# EAGLE design voltageconverter (EAGLE 5.06)
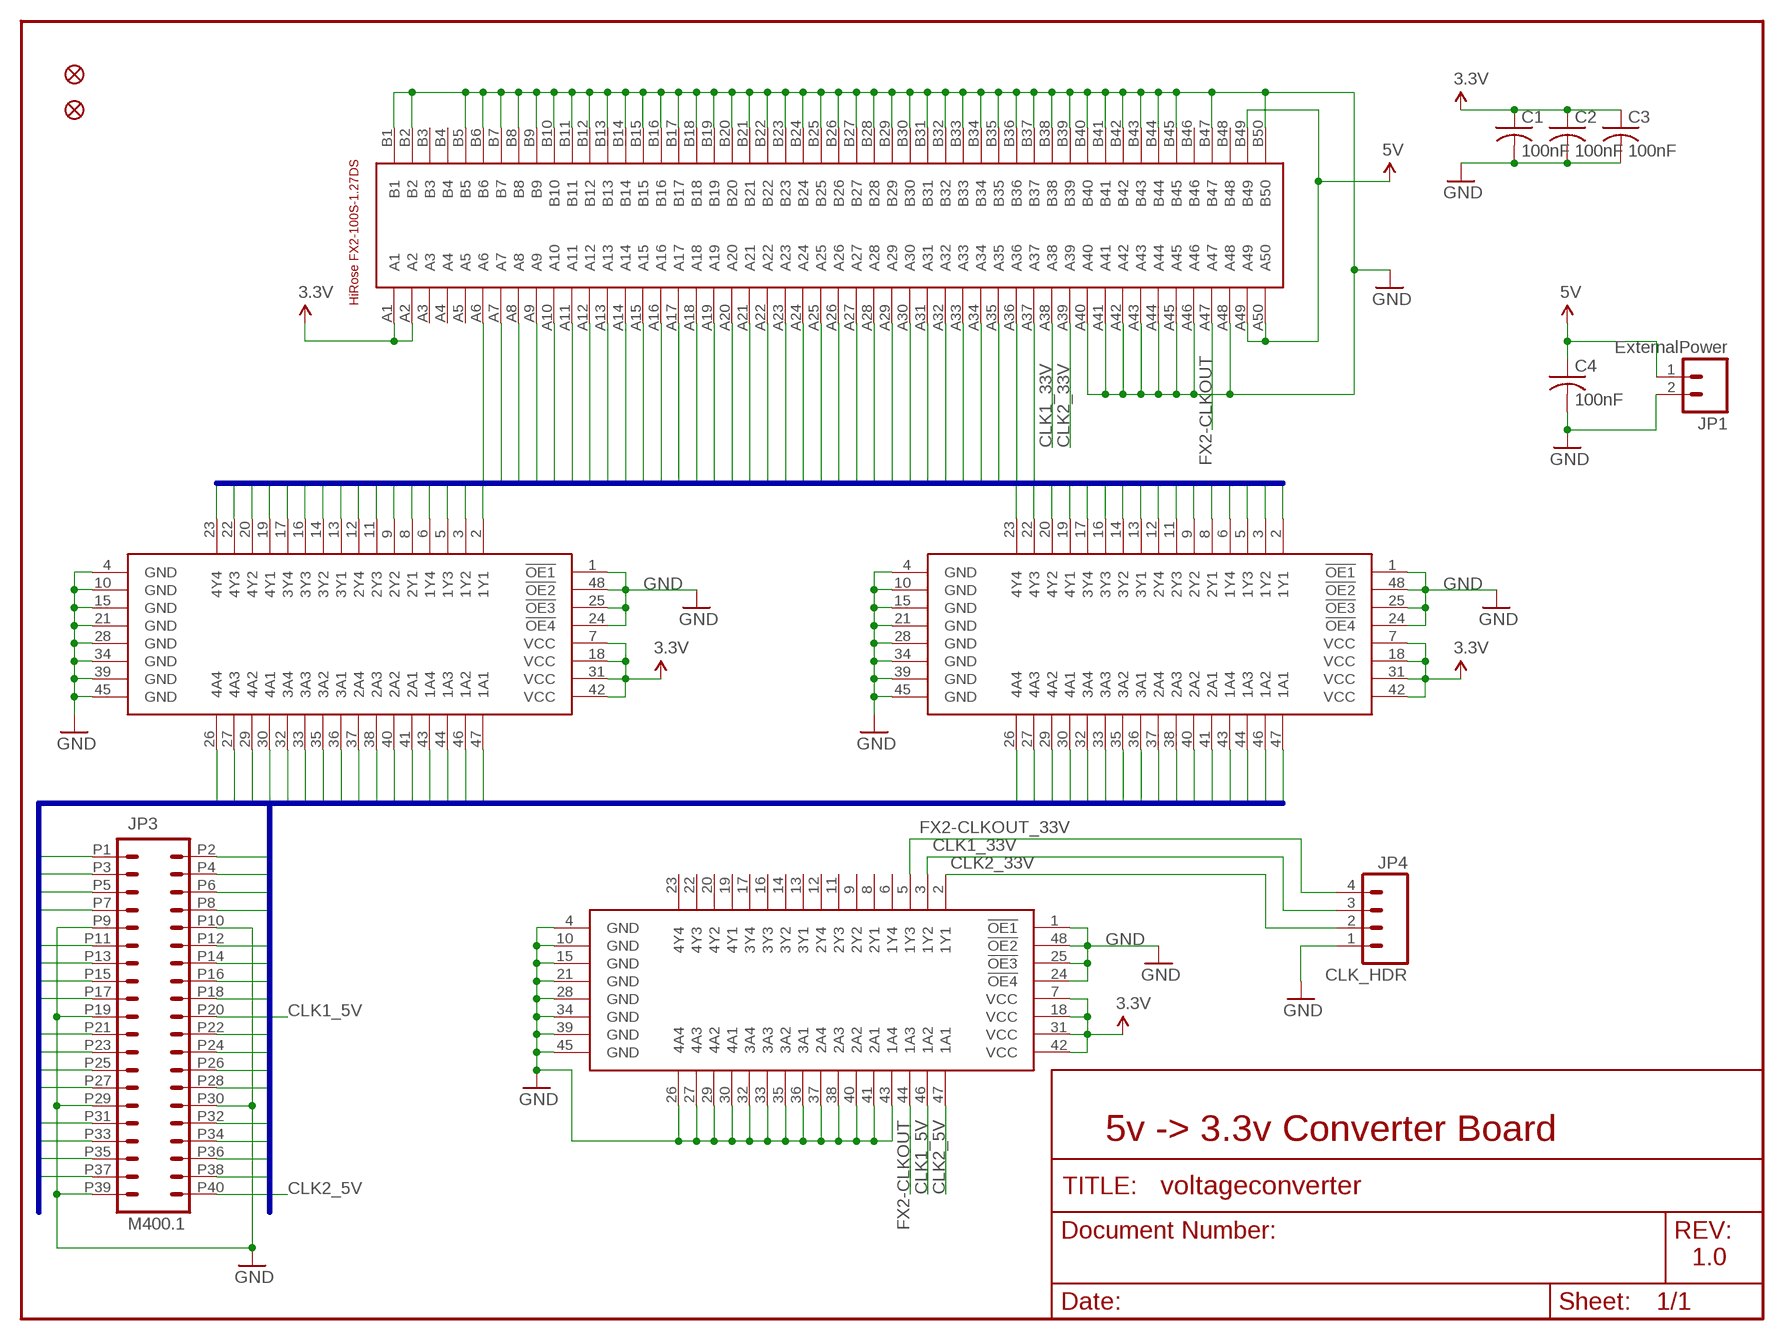
[diagram p0: schematic, sheet 1]

## Parts
C1  100nF  C-US025-025X050  [C025-025X050]
C2  100nF  C-US025-025X050  [C025-025X050]
C3  100nF  C-US025-025X050  [C025-025X050]
C4  100nF  C-US025-025X050  [C025-025X050]
JP1  ExternalPower  M02PTH  [1X02]
JP3  M400.1  M40  [2X20]
JP4  CLK_HDR  M04PTH  [1X04]
U$1  HIROSE-FX2-100S-1.27DS  [HIROSE-FX2-100]
U$3  SN74ALVTH16244GR  [TSSOP48]
U$4  SN74ALVTH16244GR  [TSSOP48]
U$5  SN74ALVTH16244GR  [TSSOP48]
U$6  FIDUCIAL1X2  [FIDUCIAL-1X2]
U$7  FIDUCIAL1X2  [FIDUCIAL-1X2]

## Nets
3.3V: C1.1 C2.1 C3.1 U$1.A1 U$1.A2 U$3.7(VCC) U$3.18(VCC) U$3.31(VCC) U$3.42(VCC) U$4.7(VCC) U$4.18(VCC) U$4.31(VCC) U$4.42(VCC) U$5.7(VCC) U$5.18(VCC) U$5.31(VCC) U$5.42(VCC)
5V: C4.1 JP1.1 U$1.A49 U$1.A50 U$1.B49
CLK1_5V: JP3.P20 U$5.46(1A2)
CLK1_33V: JP4.3 U$1.A38 U$5.3(1Y2)
CLK2_5V: JP3.P40 U$5.47(1A1)
CLK2_33V: JP4.2 U$1.A39 U$5.2(1Y1)
FX2-CLKOUT: U$1.A47 U$5.44(1A3)
FX2-CLKOUT_33V: JP4.4 U$5.5(1Y3)
GND: C1.2 C2.2 C3.2 C4.2 JP1.2 JP3.P9 JP3.P10 JP3.P19 JP3.P29 JP3.P30 JP3.P39 JP4.1 U$1.A40 U$1.A41 U$1.A42 U$1.A43 U$1.A44 U$1.A45 U$1.A46 U$1.A48 U$1.B1 U$1.B2 U$1.B5 U$1.B6 U$1.B7 U$1.B8 U$1.B9 U$1.B10 U$1.B11 U$1.B12 U$1.B13 U$1.B14 U$1.B15 U$1.B16 U$1.B17 U$1.B18 U$1.B19 U$1.B20 U$1.B21 U$1.B22 U$1.B23 U$1.B24 U$1.B25 U$1.B26 U$1.B27 U$1.B28 U$1.B29 U$1.B30 U$1.B31 U$1.B32 U$1.B33 U$1.B34 U$1.B35 U$1.B36 U$1.B37 U$1.B38 U$1.B39 U$1.B40 U$1.B41 U$1.B42 U$1.B43 U$1.B44 U$1.B45 U$1.B47 U$1.B50 U$3.1(!OE1) U$3.4(GND) U$3.10(GND) U$3.15(GND) U$3.21(GND) U$3.24(!OE4) U$3.25(!OE3) U$3.28(GND) U$3.34(GND) U$3.39(GND) U$3.45(GND) U$3.48(!OE2) U$4.1(!OE1) U$4.4(GND) U$4.10(GND) U$4.15(GND) U$4.21(GND) U$4.24(!OE4) U$4.25(!OE3) U$4.28(GND) U$4.34(GND) U$4.39(GND) U$4.45(GND) U$4.48(!OE2) U$5.1(!OE1) U$5.4(GND) U$5.10(GND) U$5.15(GND) U$5.21(GND) U$5.24(!OE4) U$5.25(!OE3) U$5.26(4A4) U$5.27(4A3) U$5.28(GND) U$5.29(4A2) U$5.30(4A1) U$5.32(3A4) U$5.33(3A3) U$5.34(GND) U$5.35(3A2) U$5.36(3A1) U$5.37(2A4) U$5.38(2A3) U$5.39(GND) U$5.40(2A2) U$5.41(2A1) U$5.43(1A4) U$5.45(GND) U$5.48(!OE2)
PROBEINPUT0: U$1.A6 U$4.23(4Y4)
PROBEINPUT1: U$1.A7 U$4.22(4Y3)
PROBEINPUT2: U$1.A8 U$4.20(4Y2)
PROBEINPUT3: U$1.A9 U$4.19(4Y1)
PROBEINPUT4: U$1.A10 U$4.17(3Y4)
PROBEINPUT5: U$1.A11 U$4.16(3Y3)
PROBEINPUT6: U$1.A12 U$4.14(3Y2)
PROBEINPUT7: U$1.A13 U$4.13(3Y1)
PROBEINPUT8: U$1.A14 U$4.12(2Y4)
PROBEINPUT9: U$1.A15 U$4.11(2Y3)
PROBEINPUT10: U$1.A16 U$4.9(2Y2)
PROBEINPUT11: U$1.A17 U$4.8(2Y1)
PROBEINPUT12: U$1.A18 U$4.6(1Y4)
PROBEINPUT13: U$1.A19 U$4.5(1Y3)
PROBEINPUT14: U$1.A20 U$4.3(1Y2)
PROBEINPUT15: U$1.A21 U$4.2(1Y1)
PROBEINPUT16: U$1.A22 U$3.23(4Y4)
PROBEINPUT17: U$1.A23 U$3.22(4Y3)
PROBEINPUT18: U$1.A24 U$3.20(4Y2)
PROBEINPUT19: U$1.A25 U$3.19(4Y1)
PROBEINPUT20: U$1.A26 U$3.17(3Y4)
PROBEINPUT21: U$1.A27 U$3.16(3Y3)
PROBEINPUT22: U$1.A28 U$3.14(3Y2)
PROBEINPUT23: U$1.A29 U$3.13(3Y1)
PROBEINPUT24: U$1.A30 U$3.12(2Y4)
PROBEINPUT25: U$1.A31 U$3.11(2Y3)
PROBEINPUT26: U$1.A32 U$3.9(2Y2)
PROBEINPUT27: U$1.A33 U$3.8(2Y1)
PROBEINPUT28: U$1.A34 U$3.6(1Y4)
PROBEINPUT29: U$1.A35 U$3.5(1Y3)
PROBEINPUT30: U$1.A36 U$3.3(1Y2)
PROBEINPUT31: U$1.A37 U$3.2(1Y1)
PROBEINPUT_5V0: JP3.P1 U$4.26(4A4)
PROBEINPUT_5V1: JP3.P2 U$4.27(4A3)
PROBEINPUT_5V2: JP3.P3 U$4.29(4A2)
PROBEINPUT_5V3: JP3.P4 U$4.30(4A1)
PROBEINPUT_5V4: JP3.P5 U$4.32(3A4)
PROBEINPUT_5V5: JP3.P6 U$4.33(3A3)
PROBEINPUT_5V6: JP3.P7 U$4.35(3A2)
PROBEINPUT_5V7: JP3.P8 U$4.36(3A1)
PROBEINPUT_5V8: JP3.P11 U$4.37(2A4)
PROBEINPUT_5V9: JP3.P12 U$4.38(2A3)
PROBEINPUT_5V10: JP3.P13 U$4.40(2A2)
PROBEINPUT_5V11: JP3.P14 U$4.41(2A1)
PROBEINPUT_5V12: JP3.P15 U$4.43(1A4)
PROBEINPUT_5V13: JP3.P16 U$4.44(1A3)
PROBEINPUT_5V14: JP3.P17 U$4.46(1A2)
PROBEINPUT_5V15: JP3.P18 U$4.47(1A1)
PROBEINPUT_5V16: JP3.P21 U$3.26(4A4)
PROBEINPUT_5V17: JP3.P22 U$3.27(4A3)
PROBEINPUT_5V18: JP3.P23 U$3.29(4A2)
PROBEINPUT_5V19: JP3.P24 U$3.30(4A1)
PROBEINPUT_5V20: JP3.P25 U$3.32(3A4)
PROBEINPUT_5V21: JP3.P26 U$3.33(3A3)
PROBEINPUT_5V22: JP3.P27 U$3.35(3A2)
PROBEINPUT_5V23: JP3.P28 U$3.36(3A1)
PROBEINPUT_5V24: JP3.P31 U$3.37(2A4)
PROBEINPUT_5V25: JP3.P32 U$3.38(2A3)
PROBEINPUT_5V26: JP3.P33 U$3.40(2A2)
PROBEINPUT_5V27: JP3.P34 U$3.41(2A1)
PROBEINPUT_5V28: JP3.P35 U$3.43(1A4)
PROBEINPUT_5V29: JP3.P36 U$3.44(1A3)
PROBEINPUT_5V30: JP3.P37 U$3.46(1A2)
PROBEINPUT_5V31: JP3.P38 U$3.47(1A1)
Unconnected: U$1.A3 U$1.A4 U$1.A5 U$1.B3 U$1.B4 U$1.B46 U$1.B48 U$5.6(1Y4) U$5.8(2Y1) U$5.9(2Y2) U$5.11(2Y3) U$5.12(2Y4) U$5.13(3Y1) U$5.14(3Y2) U$5.16(3Y3) U$5.17(3Y4) U$5.19(4Y1) U$5.20(4Y2) U$5.22(4Y3) U$5.23(4Y4)

## Buses
PROBEINPUT[0..31]
PROBEINPUT_5V[0..31]

## Notes on the sheet
- 5v -> 3.3v Converter Board
- 1.0

## Library data of the parts
C1-C4 = rcl:C-US: CAPACITOR, American symbol
JP1 = SparkFun:M02: Header 2 Standard 2-pin 0.1" header. Use with straight break away headers (SKU : PRT-00116), right angle break away headers (PRT-00553), swiss pins (PRT-00743), machine pins (PRT-00117), and female headers (PRT-00115). Molex polarized connector foot print use with SKU : PRT-08233 with associated crimp pins and housings.
JP3 = nall:M40: Header 40 Standard 40-pin 0.1" header. Use with straight break away headers (SKU : PRT-00116), right angle break away headers (PRT-00553), swiss pins (PRT-00743), machine pins (PRT-00117), and female headers (PRT-00115).
JP4 = SparkFun:M04: Header 4 Standard 4-pin 0.1" header. Use with straight break away headers (SKU : PRT-00116), right angle break away headers (PRT-00553), swiss pins (PRT-00743), machine pins (PRT-00117), and female headers (PRT-00115). Molex polarized connector foot print use with SKU : PRT-08231 with associated crimp pins and housings.
U$1 = hirose-fx2-100:HIROSE-FX2-100S-1.27DS
U$3-U$5 = nall:SN74ALVTH16244GR: The ?ALVTH16244 devices are 16-bit buffers/line drivers designed for 2.5-V or 3.3-V VCC operation, but with the capability to provide a TTL interface to a 5-V system environment. These devices can be used as four 4-bit buffers, two 8-bit buffers, or one 16-bit buffer.
U$6 U$7 = SparkFun:FIDUCIAL: Fiducial Alignment Points Various fiducial points for machine vision alignment.

## Board
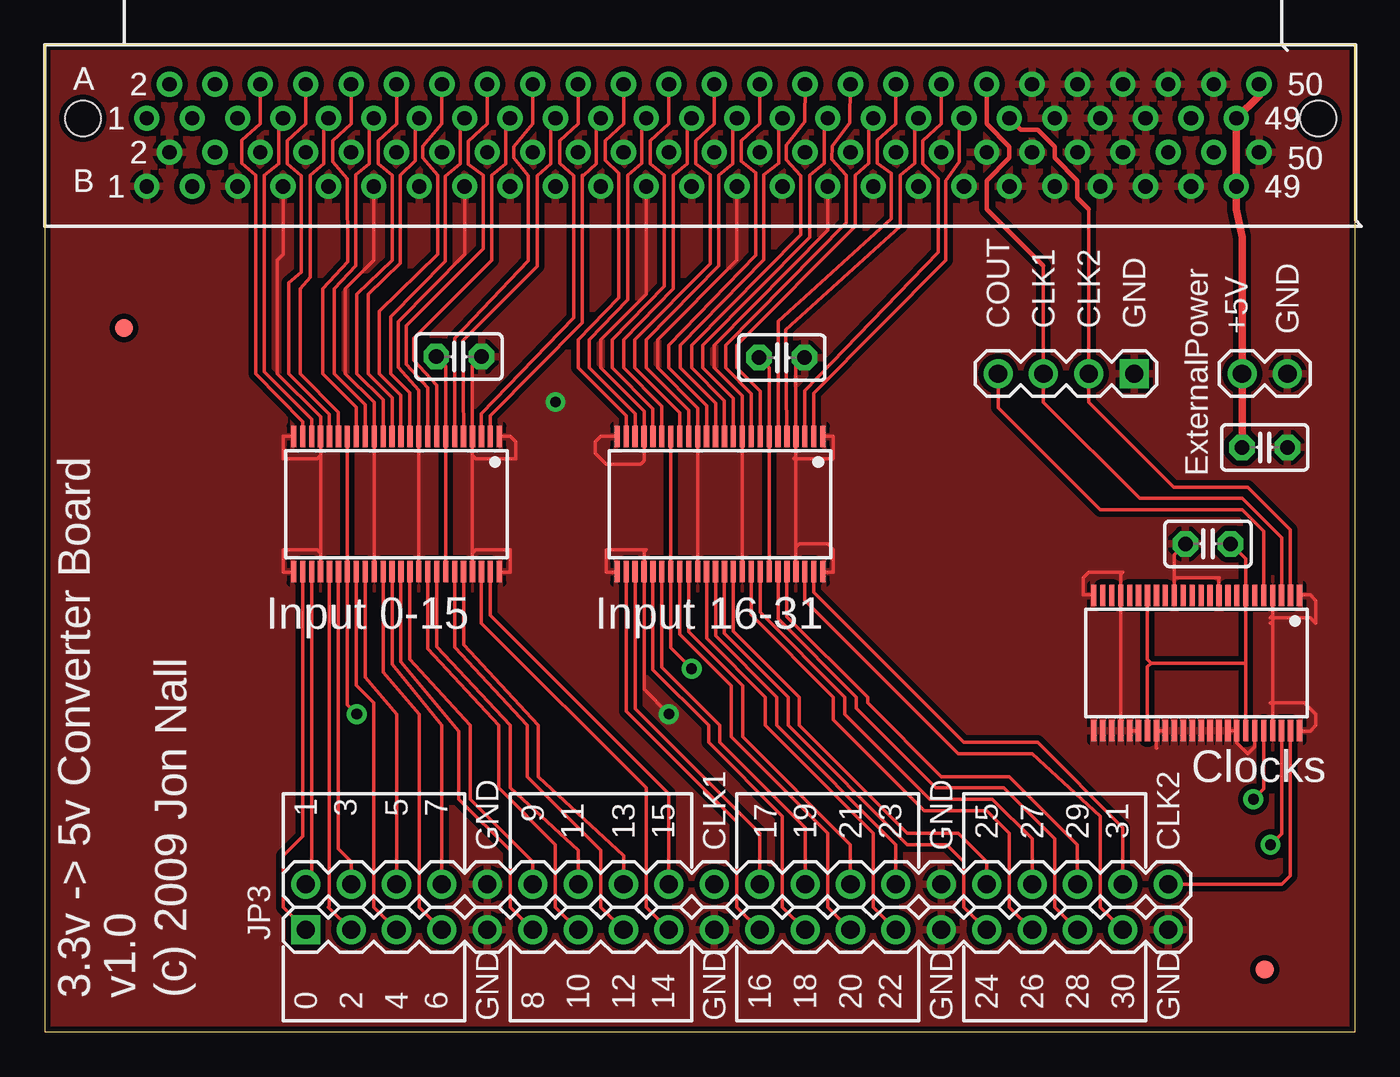
[diagram p1: board, top side]
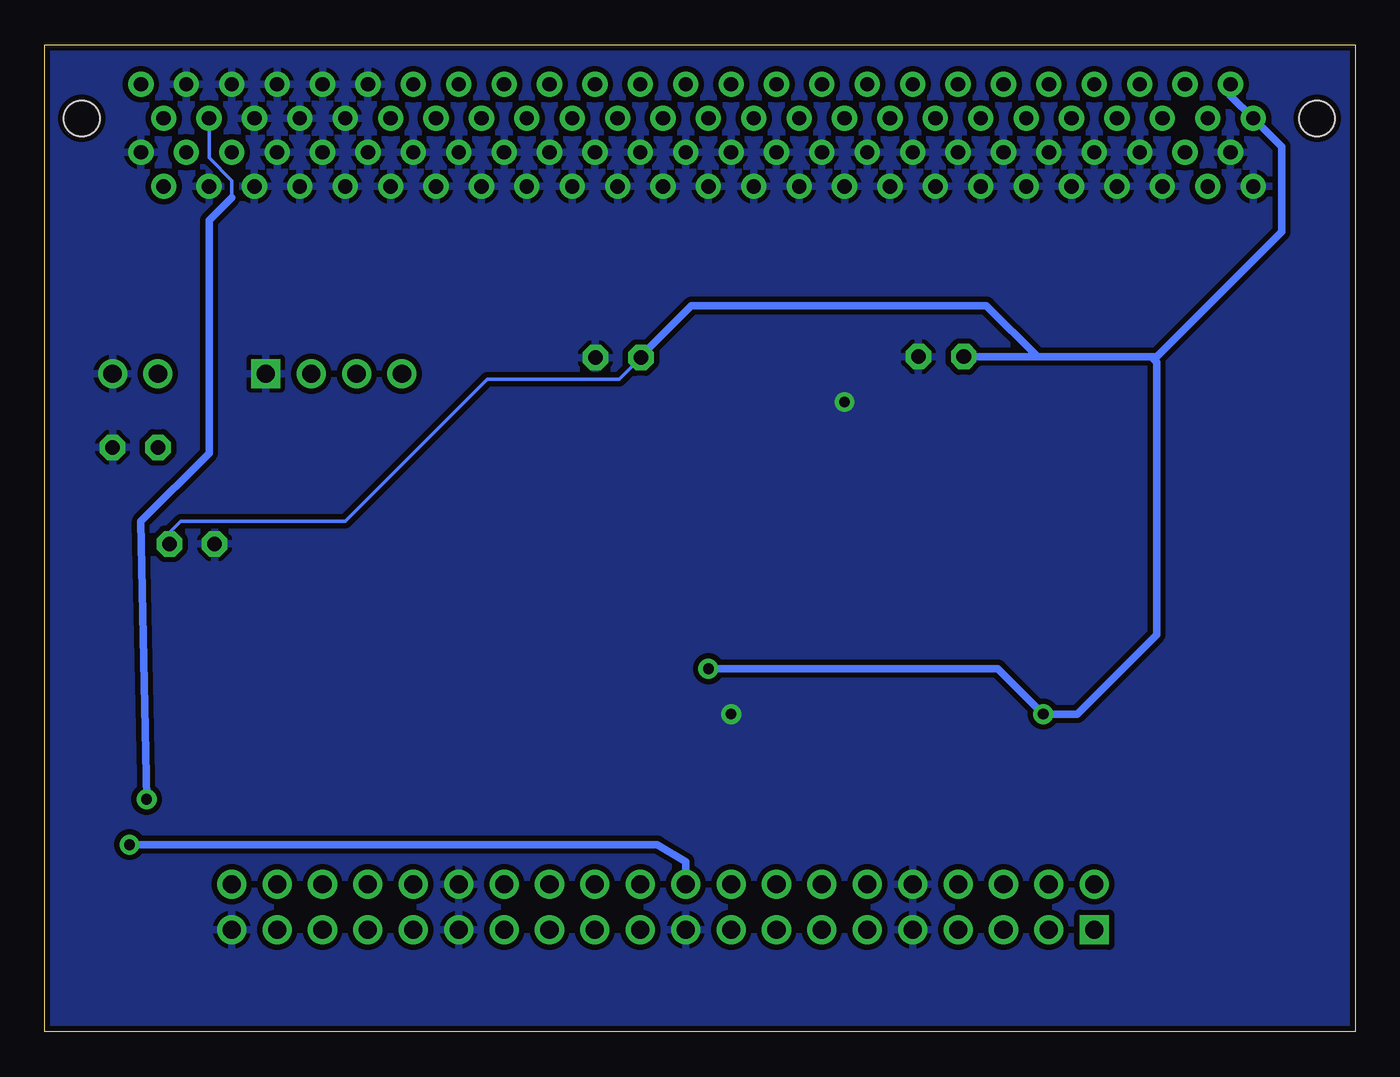
[diagram p2: board, bottom side, seen from below]

Size 73.33 x 55.23 mm. Coordinates in mm from the lower left corner, seen from the top.
Outline: 0,0 73.33,0 73.33,55.23 0,55.23 0,0
Copper layers (1*16): Top 0.035mm / dielectric 1.5mm / Bottom 0.035mm
Design rules "SparkFun": minimum track width 8mil, minimum drill 20mil, track to track 8mil, track to pad 8mil, pad to pad 8mil, via to via 8mil, smd to smd 8mil, copper to edge 10mil, drill to drill 8mil, minimum pad ring 12mil, minimum via ring 10mil, stop-mask expansion 4mil, vias tented up to drill 25mil, thermal gap 10mil

### Footprints (pad centres in the part's own frame; a part is rotated, then mirrored left to right if it is on the bottom)
C025-025X050 = drill 0.813 octagon: 1 -1.27,0; 2 1.27,0
1X02 = drill 1.016 round: 1 0,0; 2 2.54,0
2X20 = drill 1.016 square: P1 0,-2.54 | drill 1.016 round: P2 0,0; P3 2.54,-2.54; P4 2.54,0; P5 5.08,-2.54; P6 5.08,0; P7 7.62,-2.54; P8 7.62,0; P9 10.16,-2.54; P10 10.16,0; P11 12.7,-2.54; P12 12.7,0; P13 15.24,-2.54; P14 15.24,0; P15 17.78,-2.54; P16 17.78,0; P17 20.32,-2.54; P18 20.32,0; P19 22.86,-2.54; P20 22.86,0; P21 25.4,-2.54; P22 25.4,0; P23 27.94,-2.54; P24 27.94,0; P25 30.48,-2.54; P26 30.48,0; P27 33.02,-2.54; P28 33.02,0; P29 35.56,-2.54; P30 35.56,0; P31 38.1,-2.54; P32 38.1,0; P33 40.64,-2.54; P34 40.64,0; P35 43.18,-2.54; P36 43.18,0; P37 45.72,-2.54; P38 45.72,0; P39 48.26,-2.54; P40 48.26,0
1X04 = drill 1.016 square: 1 0,0 | drill 1.016 round: 2 2.54,0; 3 5.08,0; 4 7.62,0
HIROSE-FX2-100 = drill 0.8 round: A1 -44.45,6.985; A2 -43.18,8.89; A3 -41.91,6.985; A4 -40.64,8.89; A5 -39.37,6.985; A6 -38.1,8.89; A7 -36.83,6.985; A8 -35.56,8.89; A9 -34.29,6.985; A10 -33.02,8.89; A11 -31.75,6.985; A12 -30.48,8.89; A13 -29.21,6.985; A14 -27.94,8.89; A15 -26.67,6.985; A16 -25.4,8.89; A17 -24.13,6.985; A18 -22.86,8.89; A19 -21.59,6.985; A20 -20.32,8.89; A21 -19.05,6.985; A22 -17.78,8.89; A23 -16.51,6.985; A24 -15.24,8.89; A25 -13.97,6.985; A26 -12.7,8.89; A27 -11.43,6.985; A28 -10.16,8.89; A29 -8.89,6.985; A30 -7.62,8.89; A31 -6.35,6.985; A32 -5.08,8.89; A33 -3.81,6.985; A34 -2.54,8.89; A35 -1.27,6.985; A36 0,8.89; A37 1.27,6.985; A38 2.54,8.89; A39 3.81,6.985; A40 5.08,8.89; A41 6.35,6.985; A42 7.62,8.89; A43 8.89,6.985; A44 10.16,8.89; A45 11.43,6.985; A46 12.7,8.89; A47 13.97,6.985; A48 15.24,8.89; A49 16.51,6.985; A50 17.78,8.89; B1 -44.45,3.175; B2 -43.18,5.08; B3 -41.91,3.175; B4 -40.64,5.08; B5 -39.37,3.175; B6 -38.1,5.08; B7 -36.83,3.175; B8 -35.56,5.08; B9 -34.29,3.175; B10 -33.02,5.08; B11 -31.75,3.175; B12 -30.48,5.08; B13 -29.21,3.175; B14 -27.94,5.08; B15 -26.67,3.175; B16 -25.4,5.08; B17 -24.13,3.175; B18 -22.86,5.08; B19 -21.59,3.175; B20 -20.32,5.08; B21 -19.05,3.175; B22 -17.78,5.08; B23 -16.51,3.175; B24 -15.24,5.08; B25 -13.97,3.175; B26 -12.7,5.08; B27 -11.43,3.175; B28 -10.16,5.08; B29 -8.89,3.175; B30 -7.62,5.08; B31 -6.35,3.175; B32 -5.08,5.08; B33 -3.81,3.175; B34 -2.54,5.08; B35 -1.27,3.175; B36 0,5.08; B37 1.27,3.175; B38 2.54,5.08; B39 3.81,3.175; B40 5.08,5.08; B41 6.35,3.175; B42 7.62,5.08; B43 8.89,3.175; B44 10.16,5.08; B45 11.43,3.175; B46 12.7,5.08; B47 13.97,3.175; B48 15.24,5.08; B49 16.51,3.175; B50 17.78,5.08 | hole 2: 21.09,6.984; -48.032,6.985
TSSOP48 = smd 0.29 x 1.2: 1 -5.75,-3.775; 2 -5.25,-3.775; 3 -4.75,-3.775; 4 -4.25,-3.775; 5 -3.75,-3.775; 6 -3.25,-3.775; 7 -2.75,-3.775; 8 -2.25,-3.775; 9 -1.75,-3.775; 10 -1.25,-3.775; 11 -0.75,-3.775; 12 -0.25,-3.775; 13 0.25,-3.775; 14 0.75,-3.775; 15 1.25,-3.775; 16 1.75,-3.775; 17 2.25,-3.775; 18 2.75,-3.775; 19 3.25,-3.775; 20 3.75,-3.775; 21 4.25,-3.775; 22 4.75,-3.775; 23 5.25,-3.775; 24 5.75,-3.775; 25 5.75,3.775; 26 5.25,3.775; 27 4.75,3.775; 28 4.25,3.775; 29 3.75,3.775; 30 3.25,3.775; 31 2.75,3.775; 32 2.25,3.775; 33 1.75,3.775; 34 1.25,3.775; 35 0.75,3.775; 36 0.25,3.775; 37 -0.25,3.775; 38 -0.75,3.775; 39 -1.25,3.775; 40 -1.75,3.775; 41 -2.25,3.775; 42 -2.75,3.775; 43 -3.25,3.775; 44 -3.75,3.775; 45 -4.25,3.775; 46 -4.75,3.775; 47 -5.25,3.775; 48 -5.75,3.775
FIDUCIAL-1X2 = smd 1 x 1: 1 0,0

### Placement (x,y rotation side)
C1  65.09,27.3 180 top
C2  41.25,37.72 0 top
C3  23.18,37.78 0 top
C4  68.26,32.7 0 top
JP1  66.99,36.83 0 top
JP3  14.61,8.26 0 top
JP4  60.96,36.83 180 top
U$1  50.16,44.13 0 top
U$3  37.78,29.53 180 top
U$4  19.68,29.53 180 top
U$5  64.45,20.64 180 top
U$6  68.26,3.49 180 top
U$7  4.45,39.37 180 top

### Tracks (layer width: path | path; a pad name or v marks a point on that pad's centre or on a via)
3.3V  (via drill 0.6)
  Top 0.203: C3.1 22.43,37.26 U$4.7 U$4.42 | U$3.42 U$3.7 40.53,37.17 C2.1 | v17.46,17.78 16.93,18.31 U$4.31 U$4.18 | v36.2,20.32 35.03,21.48 U$3.31 U$3.18 | C1.1 67.2,26.46 U$5.7 67.2,20.64 | 67.2,20.64 U$5.42 | U$5.31 61.7,20.43 61.91,20.64 | 67.2,20.64 61.91,20.64 | U$5.18 61.7,20.85 61.91,20.64
  Bottom 0.203: C1.1 66.36,27.94 65.72,28.57 56.52,28.57 48.58,36.51 41.19,36.51 C2.1
  Bottom 0.406: U$1.A2 6.99,52.39 U$1.A1 4.13,49.53 4.13,44.77 11.11,37.78 11.43,37.78 | 11.43,37.78 17.78,37.78 | 17.78,37.78 C3.1 | 11.43,37.78 11.11,37.47 11.11,22.23 15.56,17.78 v17.46,17.78 20,20.32 v36.2,20.32 | C2.1 39.98,37.81 37.15,40.64 20.64,40.64 17.78,37.78
5V
  Top 0.406: C4.1 JP1.1 66.99,44.45 66.67,46.04 U$1.B49 U$1.A49 67.94,52.39 U$1.A50
CLK1_5V  (via drill 0.6)
  Top 0.203: U$5.46 69.2,11.1 v68.58,10.48
  Bottom 0.406: v68.58,10.48 39.05,10.48 37.47,9.53 JP3.P20
CLK1_33V
  Top 0.203: U$5.3 69.2,27.64 66.99,29.84 61.28,29.84 55.88,35.24 JP4.3 55.88,42.86
  Top 0.254: 55.88,42.86 52.7,46.04 52.7,47.62 53.98,48.9 53.98,49.53 52.7,50.8 U$1.A38
CLK2_5V
  Top 0.203: U$5.47 69.7,8.74 69.22,8.26 JP3.P40
CLK2_33V
  Top 0.203: U$5.2 69.7,28.09 67.31,30.48 63.18,30.48 58.42,35.24 JP4.2 58.42,46.04
  Top 0.254: 58.42,46.04 57.78,46.67 57.78,47.62 56.52,48.9 56.52,49.53 55.56,50.48 54.61,50.48 U$1.A39
FX2-CLKOUT  (via drill 0.6)
  Top 0.203: U$5.44 68.2,13.59 v67.63,13.02
  Bottom 0.203: 62.87,46.67 62.87,47.62 64.14,48.9 U$1.A47
  Bottom 0.406: 62.87,46.67 64.14,45.4 64.14,32.38 67.94,28.57 v67.63,13.02
FX2-CLKOUT_33V
  Top 0.203: U$5.5 68.2,28 66.99,29.21 59.05,29.21 53.34,34.92 JP4.4
GND  (via drill 0.6)
  Top 0.203: v34.92,17.78 33.53,19.17 U$3.28 33.53,26.86 33.66,26.99 31.43,26.99 31.43,25.72 32,25.72 U$3.25 | U$1.B11 18.41,43.18 16.83,41.59 16.83,36.83 18.43,35.22 U$4.15 U$4.34 | U$4.4 23.93,37.27 C3.2 | U$1.B15 23.5,43.5 19.8,39.72 19.8,37.18 20.93,35.9 U$4.10 U$4.39 | U$4.21 15.44,34.41 13.02,36.83 13.02,43.18 13.34,43.5 U$1.B7 | U$3.4 42.03,37.24 C2.2 | U$1.B31 43.81,44.86 37.47,38.42 37.47,37.15 39.03,35.58 U$3.10 U$3.39 | U$1.B27 38.73,43.18 34.29,38.73 34.29,37.15 36.53,34.91 U$3.15 U$3.34 | U$1.B23 33.66,41.27 31.11,38.73 31.11,37.15 33.53,34.73 U$3.21 33.53,31.95 33.34,31.75 31.43,31.75 30.8,32.38 30.8,33.02 31.11,33.34 32,33.34 U$3.24 | U$3.4 U$3.45 42.03,27.11 42.23,27.3 43.81,27.3 44.13,26.99 44.13,25.72 43.57,25.72 U$3.48 | U$4.21 U$4.28 15.44,26.79 15.24,26.99 13.34,26.99 13.34,25.72 13.9,25.72 U$4.25 | U$4.4 U$4.45 23.93,26.79 24.13,26.99 26.04,26.99 26.04,25.72 25.47,25.72 U$4.48 | U$5.28 U$5.21 60.2,25.59 60.33,25.72 58.42,25.72 58.1,25.4 58.1,24.45 58.67,24.45 U$5.24 | U$5.4 U$5.45 68.7,18.29 68.58,18.41 70.48,18.41 71.12,17.78 71.12,17.14 70.8,16.83 70.24,16.83 U$5.48 | C1.2 63.2,26.69 63.2,25.4 | 62.23,15.88 62.2,15.9 U$5.32 U$5.33 | U$5.43 67.7,15.95 67.31,15.56 66.7,16.16 U$5.41 U$5.40 | U$5.15 63.2,25.4 | U$5.10 65.7,25.38 65.72,25.4 63.2,25.4 | U$5.29 U$5.30 | U$5.4 68.7,22.98 68.58,22.86 | U$4.4 23.93,32.26 24.13,32.07 26.35,32.07 26.35,33.02 26.04,33.34 25.47,33.34 U$4.1 | U$4.21 15.44,32.26 15.24,32.07 13.34,32.07 13.34,33.34 13.9,33.34 U$4.24 | U$3.4 42.03,32.19 41.91,32.07 44.13,32.07 44.13,33.34 43.57,33.34 U$3.1 | U$5.4 68.7,23.3 68.58,23.18 70.8,23.18 71.12,22.86 71.12,24.13 70.8,24.45 70.24,24.45 U$5.1
  other vias: 28.57,35.24
  pour Bottom (isolate 0.305): 0.32,54.93 73.03,54.93 73.03,0.32 0.32,0.32 0.32,54.61
  pour Top (isolate 0.305): 0.32,54.93 73.03,54.93 73.03,0.32 0.32,0.32
PROBEINPUT0
  Top 0.203: U$4.23 14.44,34.14 11.81,36.81 11.81,47.93 11.03,48.61 11.03,49.88 12.06,50.8 U$1.A6
PROBEINPUT1
  Top 0.203: U$4.22 14.94,34.28 12.3,36.93 12.3,47.93 13.09,48.58 13.09,50.8 U$1.A7
PROBEINPUT2
  Top 0.203: U$4.20 15.94,34.55 13.65,36.83 13.65,41.91 14.36,42.49 14.36,47.89 13.59,48.58 13.59,49.85 14.61,50.8 U$1.A8
PROBEINPUT3
  Top 0.203: U$4.19 16.43,34.68 14.29,36.83 14.29,41.59 14.86,42.21 14.86,47.93 15.62,48.56 15.62,50.78 U$1.A9
PROBEINPUT4
  Top 0.203: U$4.17 17.43,34.95 15.56,36.83 15.56,41.59 16.94,43.08 16.93,47.74 16.11,48.7 16.11,49.85 17.14,50.8 U$1.A10
PROBEINPUT5
  Top 0.203: U$4.16 17.93,35.09 16.19,36.83 16.19,41.59 17.39,42.88 17.39,47.96 18.16,48.58 18.16,50.8 U$1.A11
PROBEINPUT6
  Top 0.203: U$4.14 18.93,35.36 17.46,36.83 17.46,41.27 19.43,43.16 19.43,47.93 18.66,48.58 18.66,49.85 19.68,50.8 U$1.A12
PROBEINPUT7
  Top 0.203: U$4.13 19.43,35.49 18.1,36.83 18.1,41.27 19.9,43.01 19.9,47.92 20.72,48.74 20.72,50.84 U$1.A13
PROBEINPUT8
  Top 0.203: U$4.12 19.93,35.63 18.73,36.83 18.73,40.32 21.98,43.5 21.98,47.94 21.15,48.91 21.15,49.54 22.23,50.8 U$1.A14
PROBEINPUT9
  Top 0.203: U$4.11 20.43,35.76 19.37,36.83 19.37,40.01 22.42,43.1 22.42,47.87 23.26,48.58 23.26,50.8 U$1.A15
PROBEINPUT10
  Top 0.203: U$4.9 21.43,36.03 20.22,37.35 20.22,39.5 24.53,43.81 24.53,47.94 23.69,48.55 23.69,49.82 24.77,50.8 U$1.A16
PROBEINPUT11
  Top 0.203: U$4.8 21.93,36.17 20.64,37.57 20.64,38.8 25.01,43.18 25.01,47.94 25.8,48.58 25.8,50.8 U$1.A17
PROBEINPUT12
  Top 0.203: U$4.6 22.93,38.81 27.06,43.15 27.06,47.91 26.23,48.9 26.23,49.53 27.3,50.8 U$1.A18
PROBEINPUT13
  Top 0.203: U$4.5 23.4,38.67 27.55,42.83 27.55,47.91 28.33,48.58 28.33,50.8 U$1.A19
PROBEINPUT14
  Top 0.203: U$4.3 24.43,34.59 29.6,39.96 29.6,47.9 28.82,48.59 28.82,49.86 29.84,50.8 U$1.A20
PROBEINPUT15
  Top 0.203: U$4.2 24.93,34.46 30.08,39.69 30.08,47.94 30.16,47.94 30.87,48.58 30.87,50.8 U$1.A21
PROBEINPUT16
  Top 0.203: U$3.23 32.53,34.46 29.84,37.15 29.84,38.73 32.13,41.07 32.13,48.04 31.35,48.77 31.35,49.86 32.38,50.8 U$1.A22
PROBEINPUT17
  Top 0.203: U$3.22 33.03,34.59 30.48,37.15 30.48,38.73 32.62,40.96 32.62,47.94 33.42,48.59 33.42,50.82 U$1.A23
PROBEINPUT18
  Top 0.203: U$3.20 34.03,34.87 31.75,37.15 31.75,38.73 34.67,41.72 34.67,47.94 33.88,48.58 33.88,49.85 34.92,50.8 U$1.A24
PROBEINPUT19
  Top 0.203: U$3.19 34.53,35 32.38,37.15 32.38,38.73 35.18,41.59 35.18,47.94 35.96,48.58 35.96,50.8 U$1.A25
PROBEINPUT20
  Top 0.203: U$3.17 35.53,34.63 33.02,37.15 33.02,38.73 37.24,42.97 37.24,47.96 36.42,48.58 36.42,49.85 37.47,50.8 U$1.A26
PROBEINPUT21
  Top 0.203: U$3.16 36.03,34.77 33.66,37.15 33.66,38.73 37.72,42.86 37.72,47.94 38.5,48.58 38.5,50.8 U$1.A27
PROBEINPUT22
  Top 0.203: U$3.14 37.03,35.04 34.92,37.15 34.92,38.42 39.78,43.45 39.78,48.07 38.97,48.7 38.97,49.85 40.01,50.8 U$1.A28
PROBEINPUT23
  Top 0.203: U$3.13 37.53,35.17 35.56,37.15 35.56,38.42 40.24,43.2 40.24,47.96 41.07,48.61 41.07,50.83 U$1.A29
PROBEINPUT24
  Top 0.203: U$3.12 38.03,35.31 36.2,37.15 36.2,38.42 42.29,44.61 42.29,47.9 41.5,48.8 41.5,49.61 42.53,50.91 U$1.A30
PROBEINPUT25
  Top 0.203: U$3.11 38.53,35.45 36.83,37.15 36.83,38.42 42.8,44.45 42.8,47.94 43.62,48.61 43.62,50.83 U$1.A31
PROBEINPUT26
  Top 0.203: U$3.9 39.53,35.72 38.1,37.15 38.1,38.42 44.85,45.26 44.85,47.94 44.04,48.83 44.05,49.56 45.05,50.86 U$1.A32
PROBEINPUT27
  Top 0.203: U$3.8 40.03,35.85 38.73,37.15 38.73,38.42 45.34,45.09 45.34,47.94 46.12,48.59 46.12,50.82 U$1.A33
PROBEINPUT28
  Top 0.203: U$3.6 41.03,39.76 47.38,45.5 47.38,48.04 46.59,48.61 46.59,49.88 47.62,50.8 U$1.A34
PROBEINPUT29
  Top 0.203: U$3.5 41.47,39.29 47.86,45.09 47.86,47.94 48.68,48.61 48.68,50.83 U$1.A35
PROBEINPUT30
  Top 0.203: U$3.3 42.53,35.87 49.99,43.61 49.99,47.74 49.12,48.58 49.12,49.85 50.16,50.8 U$1.A36
PROBEINPUT31
  Top 0.203: U$3.2 43.03,35.73 50.4,43.18 50.4,47.62 51.18,48.69 51.18,50.82 U$1.A37
PROBEINPUT_5V0
  Top 0.203: U$4.26 14.44,10.94 13.34,9.84 13.34,6.99 JP3.P1
PROBEINPUT_5V1
  Top 0.203: U$4.27 14.94,8.59 JP3.P2
PROBEINPUT_5V2
  Top 0.203: U$4.29 15.94,7.04 15.88,6.99 JP3.P3
PROBEINPUT_5V3
  Top 0.203: U$4.30 16.43,10.23 17.14,9.53 JP3.P4
PROBEINPUT_5V4
  Top 0.203: U$4.32 17.43,19.39 18.41,18.41 18.41,6.99 JP3.P5
PROBEINPUT_5V5
  Top 0.203: U$4.33 17.93,19.85 19.68,17.78 JP3.P6
PROBEINPUT_5V6
  Top 0.203: U$4.35 18.93,20.12 20.95,17.78 20.95,6.99 JP3.P7
PROBEINPUT_5V7
  Top 0.203: U$4.36 19.43,20.57 22.23,17.14 JP3.P8
PROBEINPUT_5V8
  Top 0.203: U$4.37 19.93,20.7 23.18,16.83 23.18,13.02 26.04,10.16 26.04,6.99 JP3.P11
PROBEINPUT_5V9
  Top 0.203: U$4.38 20.43,20.84 23.81,17.14 23.81,13.02 27.3,9.53 JP3.P12
PROBEINPUT_5V10
  Top 0.203: U$4.40 21.43,21.43 25.4,17.14 25.4,13.65 28.57,10.48 28.57,6.99 JP3.P13
PROBEINPUT_5V11
  Top 0.203: U$4.41 21.93,21.56 26.04,17.14 26.04,13.65 29.84,10.16 JP3.P14
PROBEINPUT_5V12
  Top 0.203: U$4.43 22.93,21.52 26.99,17.14 26.99,14.29 31.11,10.16 31.11,6.99 JP3.P15
PROBEINPUT_5V13
  Top 0.203: U$4.44 23.43,21.65 27.62,17.14 27.62,14.29 32.38,9.84 JP3.P16
PROBEINPUT_5V14
  Top 0.203: U$4.46 24.43,22.87 33.66,13.65 33.66,6.99 JP3.P17
PROBEINPUT_5V15
  Top 0.203: U$4.47 24.93,23.32 34.92,13.34 JP3.P18
PROBEINPUT_5V16
  Top 0.203: U$3.26 32.53,17.95 38.73,11.75 38.73,6.99 JP3.P21
PROBEINPUT_5V17
  Top 0.203: U$3.27 33.03,18.09 40.01,11.11 JP3.P22
PROBEINPUT_5V18
  Top 0.203: JP3.P23 41.27,6.99 41.27,12.06 37.15,16.19 37.15,17.14 34.03,20.26 U$3.29
PROBEINPUT_5V19
  Top 0.203: JP3.P24 42.55,11.43 37.78,16.19 37.78,17.14 34.53,20.39 U$3.30
PROBEINPUT_5V20
  Top 0.203: JP3.P25 43.81,6.99 43.81,11.11 38.42,16.51 38.42,19.37 35.53,22.25 U$3.32
PROBEINPUT_5V21
  Top 0.203: JP3.P26 45.09,10.48 39.05,16.51 39.05,19.37 36.03,22.39 U$3.33
PROBEINPUT_5V22
  Top 0.203: U$3.35 37.03,22.02 40.32,18.73 40.32,17.14 46.35,11.11 46.35,6.99 JP3.P27
PROBEINPUT_5V23
  Top 0.203: U$3.36 37.53,22.16 40.96,18.73 40.96,17.14 47.62,10.48 JP3.P28
PROBEINPUT_5V24
  Top 0.203: U$3.37 38.03,22.29 41.59,18.73 41.59,17.14 48.26,10.48 50.48,10.48 51.44,9.53 51.44,6.99 JP3.P31
PROBEINPUT_5V25
  Top 0.203: U$3.38 38.53,22.43 42.23,18.73 42.23,17.14 48.26,11.11 51.12,11.11 52.7,9.53 JP3.P32
PROBEINPUT_5V26
  Top 0.203: U$3.40 39.53,23.33 44.13,18.73 44.13,17.46 49.21,12.38 52.7,12.38 53.98,11.11 53.98,6.99 JP3.P33
PROBEINPUT_5V27
  Top 0.203: U$3.41 40.03,23.47 44.77,18.73 44.77,17.78 49.53,13.02 53.02,13.02 55.24,10.79 JP3.P34
PROBEINPUT_5V28
  Top 0.203: U$3.43 41.03,23.1 45.4,18.73 45.4,18.1 49.85,13.65 53.66,13.65 56.52,10.79 56.52,6.99 JP3.P35
PROBEINPUT_5V29
  Top 0.203: U$3.44 41.53,23.24 46.04,18.73 46.04,18.41 50.16,14.29 53.98,14.29 57.78,10.48 JP3.P36
PROBEINPUT_5V30
  Top 0.203: U$3.46 42.53,24.14 51.12,15.56 55.24,15.56 59.05,12.06 59.05,6.99 JP3.P37
PROBEINPUT_5V31
  Top 0.203: U$3.47 43.03,24.59 51.44,16.19 55.56,16.19 60.33,11.43 JP3.P38

### Text on the board
tPlace: COUT | CLK1 | CLK2 | GND | +5V | GND | Input 0-15 | Input 16-31 | Clocks | 1 | 3 | 5 | 7 | 9 | 11 | 13 | 15 | 17 | 19 | 21 | 23 | 25 | 27 | 29 | 31 | GND | CLK1 | GND | CLK2 | 3.3v -> 5v Converter Board | v1.0 | (c) 2009 Jon Nall | 0 | 2 | 4 | 6 | GND | 8 | 10 | 12 | 14 | GND | 16 | 18 | 20 | 22 | GND | 24 | 26 | 28 | 30 | GND
_tplace: A | 2 | 50 | 1 | 49 | 2 | 50 | B | 1 | 49